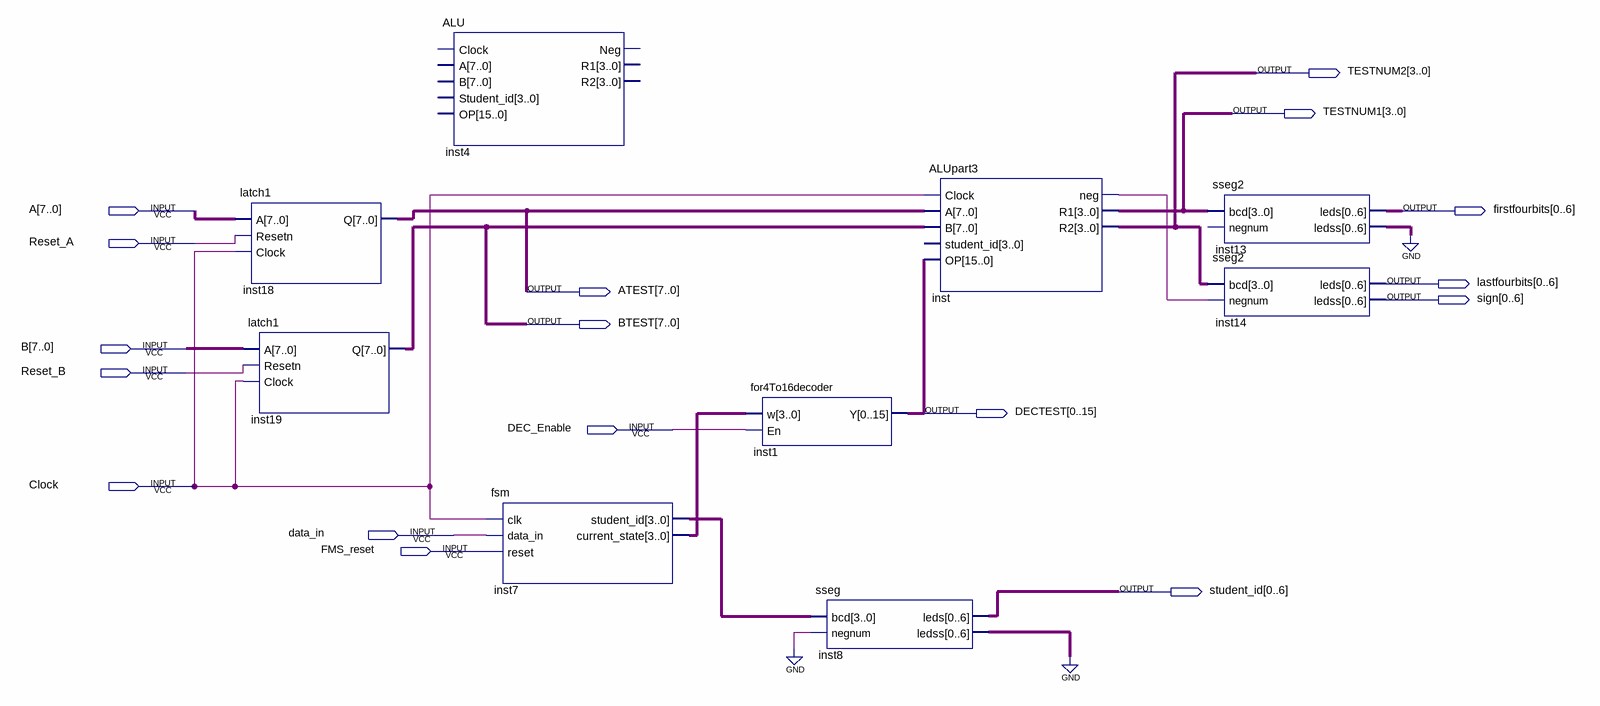
[diagram p0: schematic sheet]
// Quartus schematic Processor.bdf as structural Verilog: 9 symbols, 17 pins
module Processor (
  input  [7:0] A,
  input  Reset_A,
  input  [7:0] B,
  input  Reset_B,
  input  DEC_Enable,
  input  Clock,
  input  data_in,
  input  FMS_reset,
  output [3:0] TESTNUM2,
  output [3:0] TESTNUM1,
  output [0:6] firstfourbits,
  output [0:6] lastfourbits,
  output [7:0] ATEST,
  output [0:6] sign,
  output [7:0] BTEST,
  output [0:15] DECTEST,
  output [0:6] student_id
);

  wire inst_neg;
  wire [3:0] inst7_current_state, inst7_student_id;
  wire [6:0] inst8_ledss, inst13_ledss;

  latch1 inst18 (.A(A), .Resetn(Reset_A), .Clock(Clock), .Q(ATEST));
  latch1 inst19 (.A(B), .Resetn(Reset_B), .Clock(Clock), .Q(BTEST));
  ALU inst4 ();  // open: Clock, A, B, Student_id, OP, Neg, R1, R2
  fsm inst7 (
    .clk(Clock), .data_in(data_in), .reset(FMS_reset), .student_id(inst7_student_id),
    .current_state(inst7_current_state));
  for4To16decoder inst1 (.w(inst7_current_state), .En(DEC_Enable), .Y(DECTEST));
  sseg inst8 (.bcd(inst7_student_id), .negnum(1'b0), .leds(student_id), .ledss(inst8_ledss));
  ALUpart3 inst (
    .Clock(Clock), .A(ATEST), .B(BTEST), .OP(DECTEST), .neg(inst_neg), .R1(TESTNUM1), .R2(TESTNUM2));  // open: student_id
  sseg2 inst13 (.bcd(TESTNUM1), .leds(firstfourbits), .ledss(inst13_ledss));  // open: negnum
  sseg2 inst14 (.bcd(TESTNUM2), .negnum(inst_neg), .leds(lastfourbits), .ledss(sign));
  // also tied to GND on the sheet: {inst8_ledss[0], inst8_ledss[1], inst8_ledss[2], inst8_ledss[3], inst8_ledss[4], inst8_ledss[5], inst8_ledss[6], inst13_ledss[0], inst13_ledss[1], inst13_ledss[2], inst13_ledss[3], inst13_ledss[4], inst13_ledss[5], inst13_ledss[6]}
endmodule
